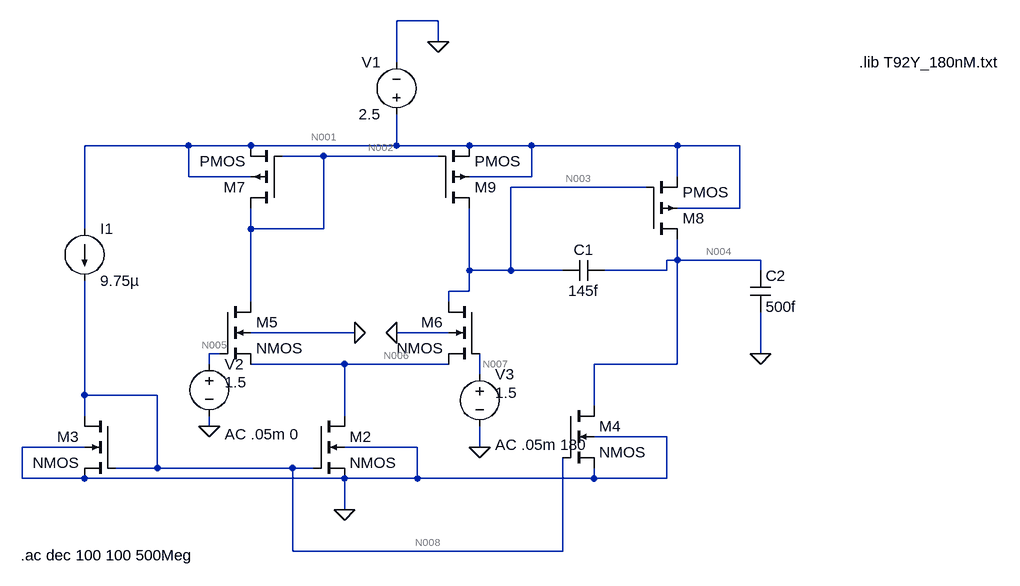
[diagram p0: schematic testing.asc]
testing.asc, the LTspice schematic file:
Version 4
SHEET 1 880 1496
WIRE -1440 656 -1504 656
WIRE -1440 688 -1440 656
WIRE -1504 720 -1504 656
WIRE -1824 848 -1984 848
WIRE -1728 848 -1824 848
WIRE -1504 848 -1504 800
WIRE -1504 848 -1728 848
WIRE -1392 848 -1504 848
WIRE -1296 848 -1392 848
WIRE -1072 848 -1296 848
WIRE -976 848 -1072 848
WIRE -1616 864 -1680 864
WIRE -1440 864 -1616 864
WIRE -1824 896 -1824 848
WIRE -1728 896 -1824 896
WIRE -1296 896 -1296 848
WIRE -1296 896 -1392 896
WIRE -1072 896 -1072 848
WIRE -1120 912 -1328 912
WIRE -976 944 -976 848
WIRE -976 944 -1072 944
WIRE -1984 976 -1984 848
WIRE -1728 976 -1728 944
WIRE -1616 976 -1616 864
WIRE -1616 976 -1728 976
WIRE -1072 1024 -1072 992
WIRE -1072 1024 -1088 1024
WIRE -944 1024 -1072 1024
WIRE -1392 1040 -1392 944
WIRE -1328 1040 -1328 912
WIRE -1328 1040 -1392 1040
WIRE -1248 1040 -1328 1040
WIRE -1088 1040 -1088 1024
WIRE -1088 1040 -1184 1040
WIRE -944 1040 -944 1024
WIRE -1392 1072 -1392 1040
WIRE -1392 1072 -1424 1072
WIRE -1728 1088 -1728 976
WIRE -1424 1088 -1424 1072
WIRE -1568 1136 -1728 1136
WIRE -1424 1136 -1504 1136
WIRE -1776 1168 -1792 1168
WIRE -944 1168 -944 1104
WIRE -1792 1184 -1792 1168
WIRE -1584 1184 -1728 1184
WIRE -1424 1184 -1584 1184
WIRE -1072 1184 -1072 1024
WIRE -1072 1184 -1200 1184
WIRE -1376 1200 -1376 1168
WIRE -1984 1232 -1984 1056
WIRE -1872 1232 -1984 1232
WIRE -1200 1248 -1200 1184
WIRE -1984 1264 -1984 1232
WIRE -1584 1264 -1584 1184
WIRE -1792 1280 -1792 1264
WIRE -1088 1296 -1200 1296
WIRE -1984 1312 -2080 1312
WIRE -1472 1312 -1584 1312
WIRE -1376 1312 -1376 1280
WIRE -1872 1344 -1872 1232
WIRE -1872 1344 -1936 1344
WIRE -1664 1344 -1872 1344
WIRE -1632 1344 -1664 1344
WIRE -2080 1360 -2080 1312
WIRE -1984 1360 -2080 1360
WIRE -1584 1360 -1984 1360
WIRE -1472 1360 -1472 1312
WIRE -1472 1360 -1584 1360
WIRE -1200 1360 -1200 1344
WIRE -1200 1360 -1472 1360
WIRE -1088 1360 -1088 1296
WIRE -1088 1360 -1200 1360
WIRE -1584 1408 -1584 1360
WIRE -1664 1472 -1664 1344
WIRE -1248 1472 -1248 1328
WIRE -1248 1472 -1664 1472
FLAG -1584 1408 0
FLAG -944 1168 0
FLAG -1440 688 0
FLAG -1568 1136 0
FLAG -1504 1136 0
FLAG -1792 1280 0
FLAG -1376 1312 0
SYMBOL nmos4 -1632 1264 R0
SYMATTR InstName M2
SYMATTR Value2 l=1u w=1u
SYMBOL nmos4 -1936 1264 M0
SYMATTR InstName M3
SYMATTR Value2 l=1u w=1u
SYMBOL nmos4 -1248 1248 R0
SYMATTR InstName M4
SYMATTR Value2 l=1u w=12.2u
SYMBOL nmos4 -1776 1088 R0
SYMATTR InstName M5
SYMATTR Value2 l=1u w=4u
SYMBOL nmos4 -1376 1088 M0
SYMATTR InstName M6
SYMATTR Value2 l=1u w=4u
SYMBOL pmos4 -1680 944 R180
SYMATTR InstName M7
SYMATTR Value2 l=1u w=2u
SYMBOL pmos4 -1440 944 M180
SYMATTR InstName M9
SYMATTR Value2 l=1u w=2u
SYMBOL current -1984 976 R0
WINDOW 123 0 0 Left 2
WINDOW 39 0 0 Left 2
SYMATTR InstName I1
SYMATTR Value 9.75µ
SYMBOL pmos4 -1120 992 M180
SYMATTR InstName M8
SYMATTR Value2 l=1u w=50u
SYMBOL cap -960 1040 R0
SYMATTR InstName C2
SYMATTR Value 500f
SYMBOL voltage -1504 816 R180
WINDOW 0 24 96 Left 2
WINDOW 3 24 16 Left 2
WINDOW 123 0 0 Left 2
WINDOW 39 0 0 Left 2
SYMATTR InstName V1
SYMATTR Value 2.5
SYMBOL voltage -1792 1168 R0
WINDOW 123 24 124 Left 2
WINDOW 39 0 0 Left 2
WINDOW 3 24 44 Left 2
SYMATTR Value2 AC .05m 0
SYMATTR InstName V2
SYMATTR Value 1.5
SYMBOL voltage -1376 1184 R0
WINDOW 123 24 124 Left 2
WINDOW 39 0 0 Left 2
WINDOW 3 24 44 Left 2
SYMATTR Value2 AC .05m 180
SYMATTR InstName V3
SYMATTR Value 1.5
SYMBOL cap -1248 1056 R270
WINDOW 0 32 32 VTop 2
WINDOW 3 0 32 VBottom 2
SYMATTR InstName C1
SYMATTR Value 145f
TEXT -792 720 Left 2 !.lib T92Y_180nM.txt
TEXT -2082 1478 Left 2 !.ac dec 100 100 500Meg

The netlist it stands for:
* testing.asc
M2 N006 N008 0 0 NMOS l=1u w=1u
M3 N008 N008 0 0 NMOS l=1u w=1u
M4 N004 N008 0 0 NMOS l=1u w=12.2u
M5 N002 N005 N006 0 NMOS l=1u w=4u
M6 N003 N007 N006 0 NMOS l=1u w=4u
M7 N002 N002 N001 N001 PMOS l=1u w=2u
M9 N003 N002 N001 N001 PMOS l=1u w=2u
I1 N001 N008 9.75µ
M8 N004 N003 N001 N001 PMOS l=1u w=50u
C2 N004 0 500f
V1 N001 0 2.5
V2 N005 0 1.5 AC .05m 0
V3 N007 0 1.5 AC .05m 180
C1 N003 N004 145f
.model NMOS NMOS
.model PMOS PMOS
.lib standard.mos
.lib T92Y_180nM.txt
.ac dec 100 100 500Meg
.backanno
.end

* Results of the author's LTspice run, read from the files saved beside the schematic
* Operating Point, zero values left out:
*   V(n006) = 1.151 V
*   V(n008) = 987.4 mV
*   V(n004) = 2.083 V
*   V(n002) = 2.006 V
*   V(n005) = 1.5 V
*   V(n003) = 2.006 V
*   V(n007) = 1.5 V
*   V(n001) = 2.5 V
*   Id(M8) = -118.9 µA
*   Is(M8) = 118.9 µA
*   Id(M9) = -4.875 µA
*   Is(M9) = 4.875 µA
*   Id(M7) = -4.875 µA
*   Is(M7) = 4.875 µA
*   Id(M6) = 4.875 µA
*   Ib(M6) = -3.177 pA
*   Is(M6) = -4.875 µA
*   Id(M5) = 4.875 µA
*   Ib(M5) = -3.177 pA
*   Is(M5) = -4.875 µA
*   Id(M4) = 118.9 µA
*   Ib(M4) = -2.093 pA
*   Is(M4) = -118.9 µA
*   Id(M3) = 9.75 µA
*   Is(M3) = -9.75 µA
*   Id(M2) = 9.75 µA
*   Ib(M2) = -1.161 pA
*   Is(M2) = -9.75 µA
*   I(I1) = 9.75 µA
*   I(V1) = -138.4 µA
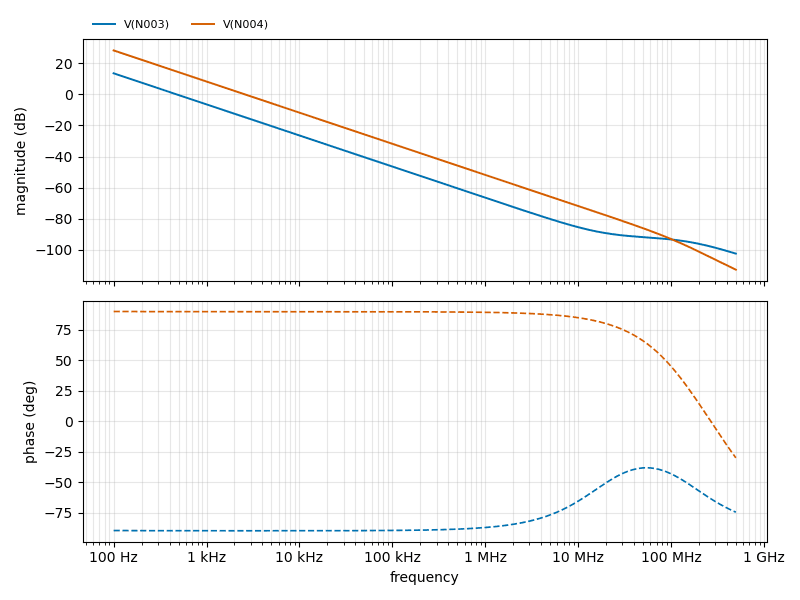
[diagram p1: AC Analysis of testing.asc, plotted from the saved traces]
* AC Analysis, 1 run:
*   V(N003): 13.53 dB at 100 Hz, -102.44 dB at 500 MHz, peak 13.53 dB at 100 Hz, 3 dB below the peak at 141.4 Hz
*   V(N004): 28.27 dB at 100 Hz, -112.77 dB at 500 MHz, peak 28.27 dB at 100 Hz, 3 dB below the peak at 141.4 Hz